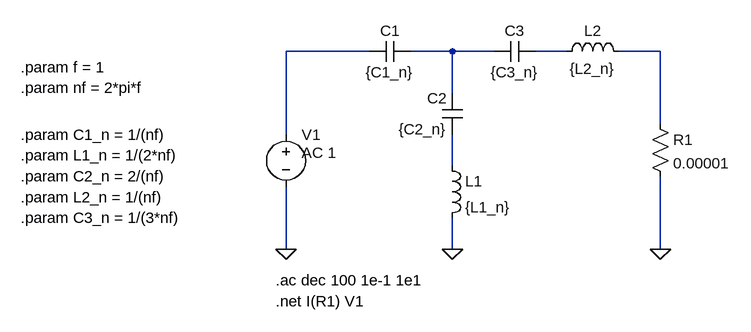
[diagram p0: schematic TPS11_ej1.asc]
TPS11_ej1.asc, the LTspice schematic file:
Version 4
SHEET 1 880 680
WIRE -1088 -544 -1216 -544
WIRE -960 -544 -1024 -544
WIRE -896 -544 -960 -544
WIRE -784 -544 -832 -544
WIRE -640 -544 -704 -544
WIRE -960 -480 -960 -544
WIRE -640 -432 -640 -544
WIRE -1216 -416 -1216 -544
WIRE -960 -368 -960 -416
WIRE -1216 -240 -1216 -336
WIRE -960 -240 -960 -288
WIRE -640 -240 -640 -352
FLAG -1216 -240 0
FLAG -960 -240 0
FLAG -640 -240 0
SYMBOL cap -1024 -560 R90
WINDOW 0 0 32 VBottom 2
WINDOW 3 32 32 VTop 2
SYMATTR InstName C1
SYMATTR Value {C1_n}
SYMBOL voltage -1216 -432 R0
WINDOW 123 24 44 Left 2
WINDOW 39 0 0 Left 2
SYMATTR Value2 AC 1
SYMATTR InstName V1
SYMATTR Value ""
SYMBOL cap -944 -416 R180
WINDOW 0 24 56 Left 2
WINDOW 3 24 8 Left 2
SYMATTR InstName C2
SYMATTR Value {C2_n}
SYMBOL ind -976 -384 R0
SYMATTR InstName L1
SYMATTR Value {L1_n}
SYMBOL cap -832 -560 R90
WINDOW 0 0 32 VBottom 2
WINDOW 3 32 32 VTop 2
SYMATTR InstName C3
SYMATTR Value {C3_n}
SYMBOL ind -800 -528 R270
WINDOW 0 32 56 VTop 2
WINDOW 3 5 56 VBottom 2
SYMATTR InstName L2
SYMATTR Value {L2_n}
SYMBOL res -656 -448 R0
SYMATTR InstName R1
SYMATTR Value 0.00001
TEXT -1232 -192 Left 2 !.ac dec 100 1e-1 1e1
TEXT -1624 -416 Left 2 !.param C1_n = 1/(nf)
TEXT -1624 -384 Left 2 !.param L1_n = 1/(2*nf)
TEXT -1624 -352 Left 2 !.param C2_n = 2/(nf)
TEXT -1624 -320 Left 2 !.param L2_n = 1/(nf)
TEXT -1624 -288 Left 2 !.param C3_n = 1/(3*nf)
TEXT -1624 -520 Left 2 !.param f = 1
TEXT -1624 -488 Left 2 !.param nf = 2*pi*f
TEXT -1232 -160 Left 2 !.net I(R1) V1

The netlist it stands for:
* TPS11_ej1.asc
C1 N002 N001 {C1_n}
V1 N001 0 AC 1
C2 N005 N002 {C2_n}
L1 N005 0 {L1_n}
C3 N003 N002 {C3_n}
L2 N003 N004 {L2_n}
R1 N004 0 0.00001
.ac dec 100 1e-1 1e1
.param C1_n = 1/(nf)
.param L1_n = 1/(2*nf)
.param C2_n = 2/(nf)
.param L2_n = 1/(nf)
.param C3_n = 1/(3*nf)
.param f = 1
.param nf = 2*pi*f
.net I(R1) V1
.backanno
.end